# Altium schematic sheet DAC_AUX.SchDoc: Auxillary DAC
size 420 x 297 mm; Author: P. Zdunek; DrawnBy: P. Zdunek; Organization: Altium Limited; Address1: L3, 12a Rodborough Rd; Address2: Frenchs Forest; Address3: NSW; Address4: Australia 2086; DocumentNumber: 11; SheetNumber: 11; SheetTotal: 37; ModifiedBy: -; CheckedDate: -; Title2: Fast Stabilizer; DivGrp: WUT ISE; Designer: G.Kasprowicz
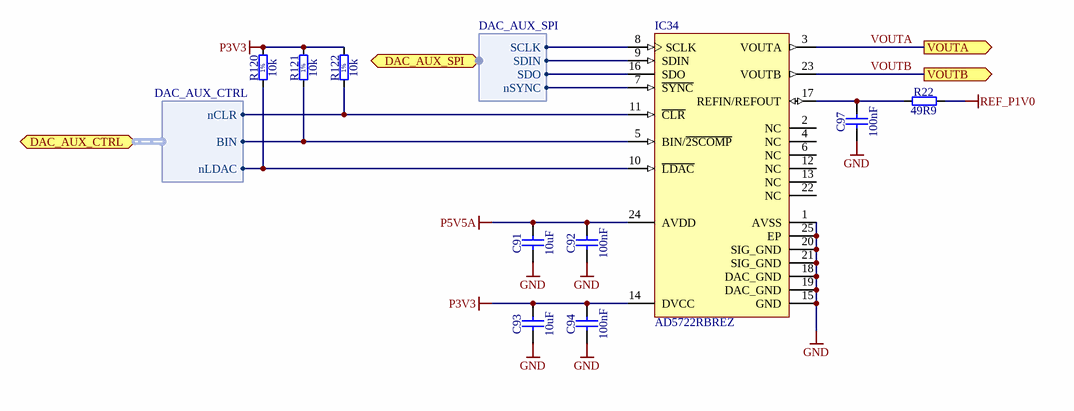
[diagram p0: DAC_AUX.SchDoc]

## Parts
C91  10uF  [CAPC1608X80N]
C92  100nF  [CAPC1005X55N]
C93  10uF  [CAPC1608X80N]
C94  100nF  [CAPC1005X55N]
C97  100nF  [CAPC1005X55N]
IC34  AD5722RBREZ  [RE-24_N]
R22  49R9  [RESC1005X40N]
R120  10k  [RESC1005X40N]
R121  10k  [RESC1005X40N]
R122  10k  [RESC1005X40N]

## Ports
DAC_AUX_CTRL (bidir, harness DAC_AUX_CTRL), DAC_AUX_SPI (bidir, harness DAC_AUX_SPI), VOUTA (out), VOUTB (out)

## Harnesses
DAC_AUX_SPI: SCLK, SDIN, SDO, nSYNC
DAC_AUX_CTRL: nCLR, BIN, nLDAC

## Nets
GND: C91.1 C92.1 C93.1 C94.1 C97.1 IC34.1(AVSS) IC34.15(GND) IC34.18(DAC_GND) IC34.19(DAC_GND) IC34.20(SIG_GND) IC34.21(SIG_GND) IC34.25(EP)
P3V3: C93.2 C94.2 IC34.14(DVCC) R120.2 R121.2 R122.2
P5V5A: C91.2 C92.2 IC34.24(AVDD)
REF_P1V0: R22.2
VOUTA: IC34.3(VOUTA) ; port VOUTA
VOUTB: IC34.23(VOUTB) ; port VOUTB
NetC97_2: C97.2 IC34.17(REFIN/REFOUT) R22.1
NetIC34_5: IC34.5(BIN/~{2SCOMP}) R121.1 ; port DAC_AUX_CTRL.BIN
NetIC34_7: IC34.7(~{SYNC}) ; port DAC_AUX_SPI.nSYNC
NetIC34_8: IC34.8(SCLK) ; port DAC_AUX_SPI.SCLK
NetIC34_9: IC34.9(SDIN) ; port DAC_AUX_SPI.SDIN
NetIC34_10: IC34.10(~{LDAC}) R120.1 ; port DAC_AUX_CTRL.nLDAC
NetIC34_11: IC34.11(~{CLR}) R122.1 ; port DAC_AUX_CTRL.nCLR
NetIC34_16: IC34.16(SDO) ; port DAC_AUX_SPI.SDO

Not connected (* = marked no-connect by the designer): IC34 2(NC) 4(NC) 6(NC) 12(NC) 13(NC) 22(NC)

## Notes on the sheet
- Project/Equipment
- Document
- Designer
- Drawn by
- Check.by
- Copyright WUT ISE 2020.
  This documentation describes Open Hardware and is licensed under the CERN OHL v.1.2. You may redistribute and modify this documentation under the terms of the CERN OHL v.1.2. (http://ohwr.org/CERNOHL). This documentation is distributed WITHOUT ANY EXPRESS OR IMPLIED WARRANTY, INCLUDING OF MERCHANTABILITY, SATISFACTORY QUALITY AND FITNESS FOR A PARTICULAR PURPOSE. Please see the CERN OHL v.1.2 for applicable conditions.
- Contact
- File
- Last Mod.
- Print Date
- Sheet
- Size
- A3
- of
- Rev
- (in symbol R0402_10K_1%_0.0625W_100PPM) 1%

## Library data of the parts
C91 C93 = CC0603_10UF_10V_10%_X5R: Non-polarised capacitor; Part Description: SMD Multilayer Chip Ceramic Capacitor; Manufacturer: GENERIC; Manufacturer1 Part Number: GRM188R61A106KE69D; Voltage: 10V; TC: X5R; Tolerance: ±10%; Part Number: CC0603_10UF_10V_10%_X5R; Component Kind: Standard; Component Type: Standard; Pin Count: 2; Value: 10uF; Status: None; Manufacturer Part Number: CC0603_10UF_10V_10%_X5R; Case: 0603; Mounted: Yes; Socket: No; SMD: Yes; Sense: No; Manufacturer1 Example: MURATA; Manufacturer1 ComponentHeight: 0.8mm; HelpURL: \\cern.ch\dfs\Applications\Altium\Datasheets\CC0603_MURATA_GRM188R61A106KE69D.pdf; Author: CERN DEM JLC; CreateDate: 31-Jan-17; LatestRevisionDate: 31-Jan-17
C92 C94 C97 = CC0402_100NF_16V_10%_X7R: Non-polarised capacitor; Part Description: SMD Multilayer Chip Ceramic Capacitor; Manufacturer: GENERIC; Manufacturer1 Part Number: GRM155R71C104KA88D; Voltage: 16V; TC: X7R; Tolerance: ±10%; Part Number: CC0402_100NF_16V_10%_X7R; Component Kind: Standard; Component Type: Standard; Pin Count: 2; Value: 100nF; Status: Not Recommended; Manufacturer Part Number: CC0402_100NF_16V_10%_X7R; Case: 0402; Mounted: Yes; Socket: No; SMD: Yes; Sense: No; Manufacturer1 Example: MURATA; Manufacturer1 ComponentHeight: 0.55mm; HelpURL: \\cern.ch\dfs\Applications\Altium\Datasheets\CC0402_X7R_MURATA_GRM.pdf; Author: CERN DEM JLC; CreateDate: 05-Dec-13; LatestRevisionDate: 03-Dec-07
IC34 = CMP-0318-01660-2: Dual 12-Bit Voltage Output Digital-to-Analog Converter with Serial Interface, -40 to +85 degC, RE-24, Pb-Free, Tube; Manufacturer: Analog Devices; Single Supply: Yes; Resolution (Bits): 12; Op Pwr Diss: 190mW; Settling Time: 7.5Âµs; # DAC Outputs: 2; Max V+: 16.5V; Packing: Tube; ComponentLink4URL: http://www.analog.com/en/digital-to-analog-converters/da-converters/ad5722r/products/product.html; ComponentLink1Description: Manufacturer URL; ComponentLink2Description: Datasheet; ComponentLink4Description: Product URL; ComponentLink3Description: Package Specification; PartNumber: AD5722RBREZ; Code_JEDEC: MO-153-ADT; RevisionNote: Component URL fixed; ComponentLink2URL: http://www.analog.com/static/imported-files/data_sheets/AD5722R_5732R_5752R.pdf; ComponentLink5URL: http://www.analog.com/en/digital-to-analog-converters/da-converters/ad5722r/products/product.html#prod_cross_sell; ComponentLink1URL: http://www.analog.com/en/index.html; PackageVersion: 050806-A; RoHS: Y; DatasheetVersion: Rev.D; Generic Part Number: AD5722R; PackageDescription: 24-Lead Thin Shrink Small Outline Package, Exposed Pad [TSSOP_EP]; ComponentLink5Description: Reference Design URL; Mounting Technology: Surface Mount; ComponentLink3URL: http://www.analog.com/static/imported-files/packages/PKG_PDF/TSSOP_EP(RE)/RE_24.pdf; PackageReference: RE-24
R22 = R0402_49R9_1%_0.0625W_100PPM: Resistor - 1%; Part Description: General Purpose Thick Film Chip Resistor; Manufacturer: GENERIC; Manufacturer1 Part Number: 232270674999L or RC0402FR-0749R9L; TC: ±100ppm/°C; PressFit: No; Part Number: R0402_49R9_1%_0.0625W_100PPM; Component Kind: Standard; Component Type: Standard; Pin Count: 2; Value: 49R9; Status: Not Recommended; Power: 0.0625W; Tolerance: ±1%; Manufacturer Part Number: R0402_49R9_1%_0.0625W_100PPM; Case: 0402; Mounted: Yes; Sense: No; Socket: No; SMD: Yes; Manufacturer1 Example: YAGEO PHYCOMP; Manufacturer1 ComponentHeight: 0.4mm; HelpURL: \\cern.ch\dfs\Applications\Altium\Datasheets\R0402_Phycomp_RC0402.pdf; Author: CERN DEM JLC; CreateDate: 24.10.2012; LatestRevisionDate: 24.10.2012
R120-R122 = R0402_10K_1%_0.0625W_100PPM: Resistor - 1%; Part Description: General Purpose Thick Film Chip Resistor; Manufacturer: GENERIC; Manufacturer1 Part Number: 232270671003L; PressFit: No; TC: ±100ppm/°C; Part Number: R0402_10K_1%_0.0625W_100PPM; Component Kind: Standard; Component Type: Standard; Pin Count: 2; Value: 10k; Status: Not Recommended; Manufacturer Part Number: R0402_10K_1%_0.0625W_100PPM; Case: 0402; Mounted: Yes; Sense: No; Socket: No; SMD: Yes; Manufacturer1 Example: YAGEO PHYCOMP; Manufacturer1 ComponentHeight: 0.4mm; HelpURL: \\cern.ch\dfs\Applications\Altium\Datasheets\R0402_Phycomp_RC0402.pdf; Author: CERN DEM JLC; CreateDate: 03-Dec-07; LatestRevisionDate: 17-Oct-12; Power: 0.0625W; Tolerance: ±1%